# Altium schematic sheet Main.SchDoc
size A4; SheetNumber: 1; SheetTotal: 1
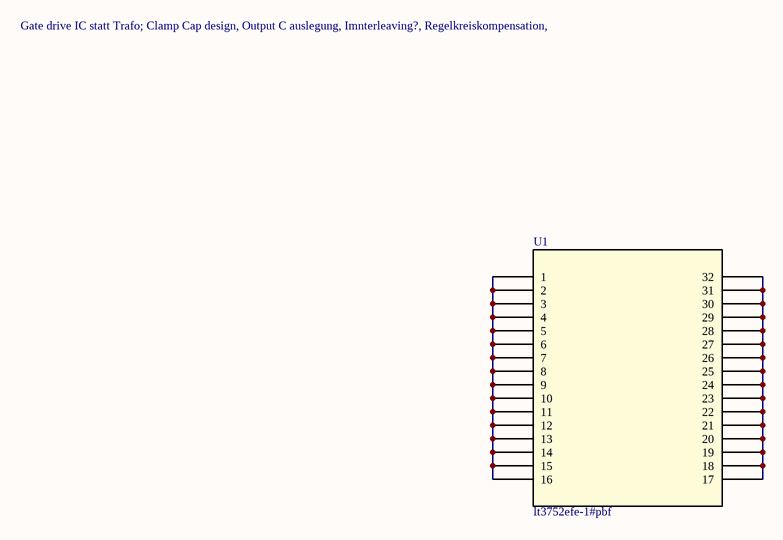
[diagram p0: Main.SchDoc]

## Parts
U1  lt3752efe-1#pbf

## Nets
NetU1_?1: U1.?1(1) U1.?2(2) U1.?3(3) U1.?4(4) U1.?5(5) U1.?6(6) U1.?7(7) U1.?8(8) U1.?9(9) U1.?10(10) U1.?11(11) U1.?12(12) U1.?13(13) U1.?14(14) U1.?15(15) U1.?16(16)
NetU1_?17: U1.?17(17) U1.?18(18) U1.?19(19) U1.?20(20) U1.?21(21) U1.?22(22) U1.?23(23) U1.?24(24) U1.?25(25) U1.?26(26) U1.?27(27) U1.?28(28) U1.?29(29) U1.?30(30) U1.?31(31) U1.?32(32)

## Notes on the sheet
- Gate drive IC statt Trafo; Clamp Cap design, Output C auslegung, Imnterleaving?, Regelkreiskompensation,

## Library data of the parts
U1 = LT3752EFE-1#PBF: No Description Available; Vendor: Linear Technology; Manufacturer_Part_Number: lt3752efe-1#pbf; Copyright: Copyright (C) 2016 Accelerated Designs. All rights reserved; RefDes: RefDes; Type: Type